# EAGLE design tex-v0 (EAGLE 7.6.0)
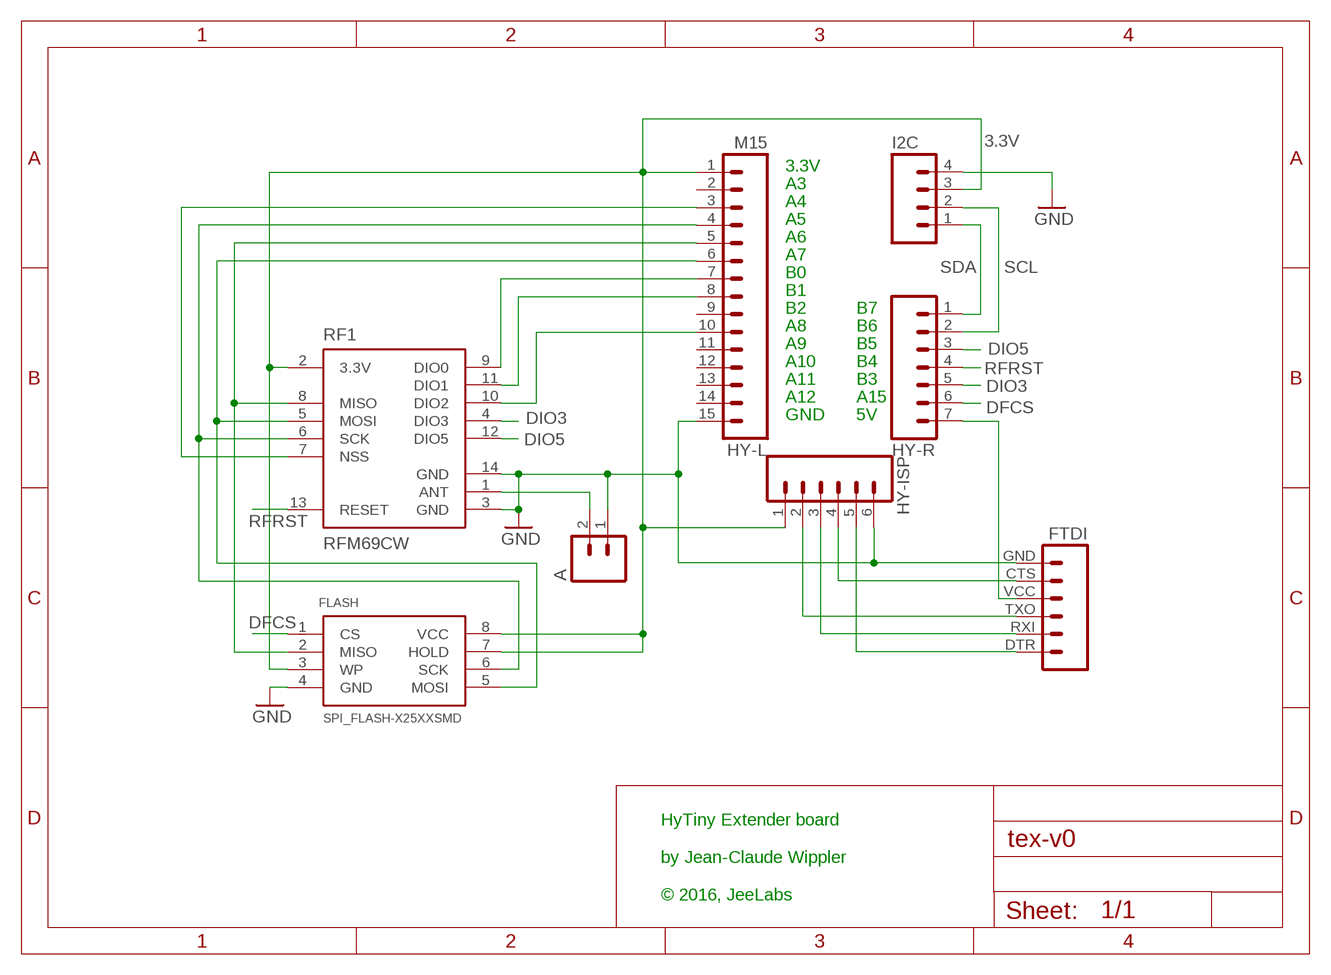
[diagram p0: schematic, sheet 1]

## Parts
A  M021X02_NO_SILK  [1X02_NO_SILK]
FLASH  SPI_FLASH-X25XXSMD  [SO08]
FTDI  FTDI_BASICPTH  [FTDI_BASIC]
HY-ISP  M06NO_SILK_FEMALE_PTH  [1X06_NO_SILK]
HY-L  M15  [1X15]
HY-R  M07  [1X07]
I2C  M041X04_NO_SILK  [1X04_NO_SILK]
RF1  RFM69CW  [RFM69CW-XXXS2]

## Nets
3.3V [power]: FLASH.3(WP) FLASH.7(HOLD) FLASH.8(VCC) HY-ISP.1 HY-L.1 I2C.3 RF1.2(3.3V)
DFCS [power]: FLASH.1(CS) HY-R.6
DIO3 [power]: HY-R.5 RF1.4(DIO3)
DIO5 [power]: HY-R.3 RF1.12(DIO5)
GND [power]: A.1 FLASH.4(GND) FTDI.GND HY-ISP.6 HY-L.15 I2C.4 RF1.3(GND) RF1.14(GND)
N$2: FLASH.2(MISO) HY-L.5 RF1.8(MISO)
N$3: FLASH.5(MOSI) HY-L.6 RF1.5(MOSI)
N$4: FLASH.6(SCK) HY-L.4 RF1.6(SCK)
N$5: HY-L.3 RF1.7(NSS)
N$6 [power]: FTDI.VCC HY-R.7
N$7: HY-L.7 RF1.9(DIO0)
N$8: HY-L.8 RF1.11(DIO1)
N$9 [power]: A.2 RF1.1(ANT)
N$10: FTDI.RXI HY-ISP.3
N$11: FTDI.TXO HY-ISP.2
N$12: FTDI.CTS HY-ISP.4
N$13: FTDI.DTR HY-ISP.5
N$14 [power]: HY-L.10 RF1.10(DIO2)
RFRST [power]: HY-R.4 RF1.13(RESET)
SCL: HY-R.2 I2C.2
SDA: HY-R.1 I2C.1
Unconnected: HY-L.2 HY-L.9 HY-L.11 HY-L.12 HY-L.13 HY-L.14

## Notes on the sheet
- 3.3V
- A3
- A4
- A5
- A6
- A7
- B0
- B1
- B2 | B7
- A8 | B6
- A9 | B5
- A10 | B4
- A11 | B3
- A12 | A15
- GND | 5V
- HyTiny Extender board
  
  by Jean-Claude Wippler
  
  © 2016, JeeLabs

## Library data of the parts
A = SparkFun-Connectors:M02: Standard 2-pin 0.1" header. Use with - straight break away headers ( PRT-00116) - right angle break away headers (PRT-00553) - swiss pins (PRT-00743) - machine pins (PRT-00117) - female headers (PRT-00115) Molex polarized connector foot print use with: PRT-08233 with associated crimp pins and housings. 2.54_SCREWTERM for use with PRT-10571. 3.5mm Screw Terminal footprints for PRT-08084 5mm Screw Terminal footprints for use with PRT-08432
FLASH = SparkFun-DigitalIC:SPI_FLASH-X25XX: 8pin SPI Flash series x25xx. Works with devices like W25X32 and BR25L32
FTDI = SparkFun-Connectors:FTDI_BASIC: FTDI Basic header with labels
HY-ISP = SparkFun-Connectors:M06: Header 6 Standard 6-pin 0.1" header. Use with straight break away headers (SKU : PRT-00116), right angle break away headers (PRT-00553), swiss pins (PRT-00743), machine pins (PRT-00117), and female headers (PRT-00115). Molex polarized connector foot print use with SKU : PRT-08094 with associated crimp pins and housings. NOTES ON THE VARIANTS LOCK and LOCK_LONGPADS... This footprint was designed to help hold the alignment of a through-hole component (i.e. 6-pin header) while soldering it into place. You may notice that each hole has been shifted either up or down by 0.005 of an inch from it's more standard position (which is a perfectly straight line). This slight alteration caused the pins (the squares in the middle) to touch the edges of the holes. Because they are alternating, it causes a "brace" to hold the component in place. 0.005 has proven to be the perfect amount of "off-center" position when using our standard breakaway headers. Although looks a little odd when you look at the bare footprint, once you have a header in there, the alteration is very hard to notice. Also,if you push a header all the way into place, it is covered up entirely on the bottom side. This idea of altering the position of holes to aid alignment will be further integrated into the Sparkfun Library for other footprints. It can help hold any component with 3 or more connection pins.; PROD_ID: CONN-08437
HY-L = SparkFun-Connectors:M15: Header 15 Standard 15-pin 0.1" header. Use with straight break away headers (SKU : PRT-00116), right angle break away headers (PRT-00553), swiss pins (PRT-00743), machine pins (PRT-00117), and female headers (PRT-00115).
HY-R = SparkFun-Connectors:M07: Header 7 Standard 7-pin 0.1" header. Use with straight break away headers (SKU : PRT-00116), right angle break away headers (PRT-00553), swiss pins (PRT-00743), machine pins (PRT-00117), and female headers (PRT-00115). NOTES ON THE VARIANTS LOCK and LOCK_LONGPADS... This footprint was designed to help hold the alignment of a through-hole component (i.e. 7-pin header) while soldering it into place. You may notice that each hole has been shifted either up or down by 0.005 of an inch from it's more standard position (which is usually a perfectly straight line). This slight alteration caused the pins (the squares in the middle) to touch the edges of the holes. Because they are alternating, it causes a "brace" to hold the header in place. 0.005 has proven to be the perfect amount of "off-center" position when using our standard breakaway headers. Although looks a little odd when you look at the bare footprint, once you have a header in there, the alteration is very hard to notice. Also, if you push a header all the way into place, it is covered up entirely on the bottom side. This idea of altering the position of holes to aid alignment will be further integrated into the Sparkfun Library for other footprints. It can help hold any component with 3 or more connection pins.
I2C = SparkFun-Connectors:M04: Header 4 Standard 4-pin 0.1" header. Use with straight break away headers (SKU : PRT-00116), right angle break away headers (PRT-00553), swiss pins (PRT-00743), machine pins (PRT-00117), and female headers (PRT-00115). Molex polarized connector foot print use with SKU : PRT-08231 with associated crimp pins and housings. 1MM SMD Version SKU: PRT-10208
RF1 = SparkFun-RF:RFM69

## Net classes
1 power: width 0.254 mm

## Board
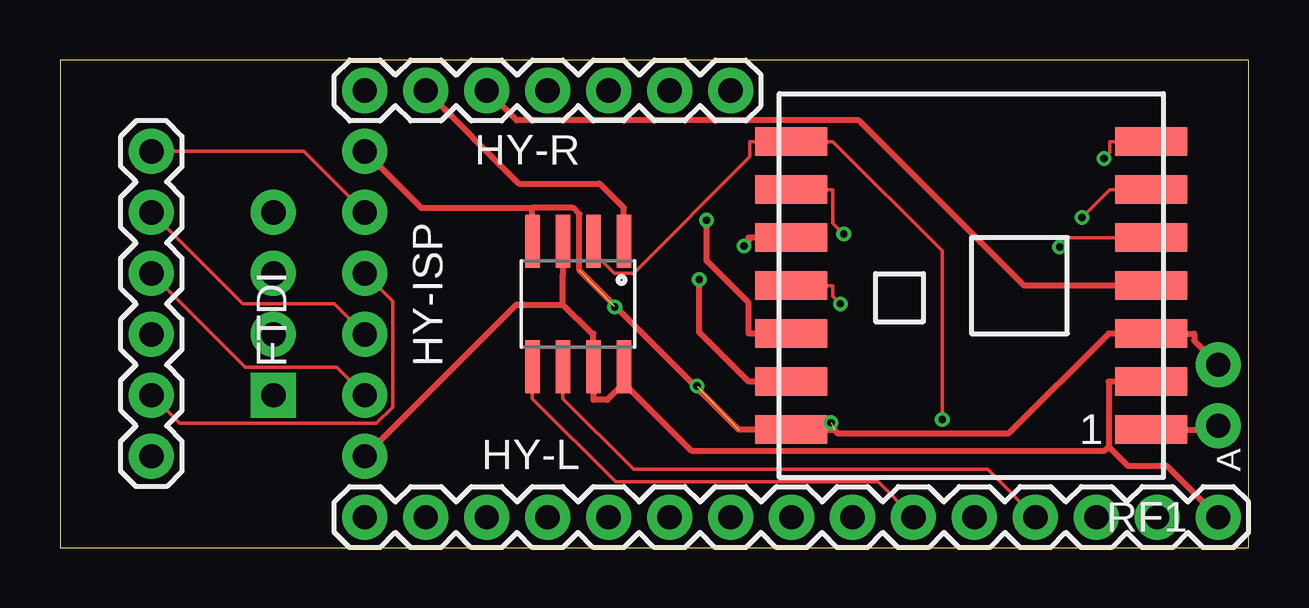
[diagram p1: board, top side]
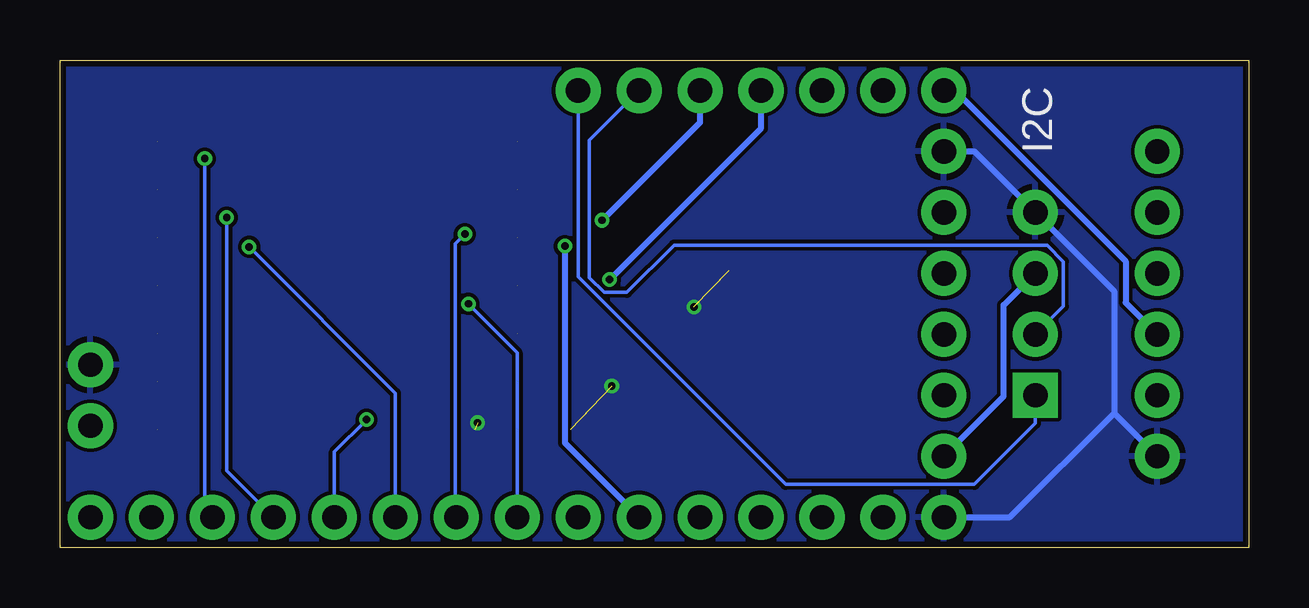
[diagram p2: board, bottom side, seen from below]

Size 49.53 x 20.32 mm. Coordinates in mm from the lower left corner, seen from the top.
Outline: 0,0 49.53,0 49.53,20.32 0,20.32 0,0
Copper layers (1*16): Top 0.035mm / dielectric 1.5mm / Bottom 0.035mm
Design rules "ITEADstudio_DRC": minimum track width 6mil, minimum drill 12mil, track to track 6mil, track to pad 6mil, pad to pad 6mil, via to via 6mil, smd to smd 0mil, copper to edge 10mil, drill to drill 10mil, minimum pad ring 10mil, minimum via ring 6mil, stop-mask expansion 2mil, vias tented up to drill 100mil, thermal gap 10mil

### Footprints (pad centres in the part's own frame; a part is rotated, then mirrored left to right if it is on the bottom)
1X02_NO_SILK = drill 1.016 pad 1.88: 1 0,0; 2 2.54,0
SO08 = smd 0.61 x 2.21: 1 -1.905,-2.616; 2 -0.635,-2.616; 3 0.635,-2.616; 4 1.905,-2.616; 5 1.905,2.616; 6 0.635,2.616; 7 -0.635,2.616; 8 -1.905,2.616
FTDI_BASIC = drill 1.016 pad 1.88: CTS 10.16,0; DTR 0,0; GND 12.7,0; RXI 2.54,0; TXO 5.08,0; VCC 7.62,0
1X06_NO_SILK = drill 1.016 pad 1.88: 1 0,0; 2 2.54,0; 3 5.08,0; 4 7.62,0; 5 10.16,0; 6 12.7,0
1X15 = drill 1.016 pad 1.88: 1 0,0; 2 2.54,0; 3 5.08,0; 4 7.62,0; 5 10.16,0; 6 12.7,0; 7 15.24,0; 8 17.78,0; 9 20.32,0; 10 22.86,0; 11 25.4,0; 12 27.94,0; 13 30.48,0; 14 33.02,0; 15 35.56,0
1X07 = drill 1.016 pad 1.88: 1 0,0; 2 2.54,0; 3 5.08,0; 4 7.62,0; 5 10.16,0; 6 12.7,0; 7 15.24,0
1X04_NO_SILK = drill 1.016 pad 1.88 square: 1 0,0 | drill 1.016 pad 1.88: 2 2.54,0; 3 5.08,0; 4 7.62,0
RFM69CW-XXXS2 = smd 3 x 1.2: 1 -7.5,6; 2 -7.5,4; 3 -7.5,2; 4 -7.5,0; 5 -7.5,-2; 6 -7.5,-4; 7 -7.5,-6; 8 7.5,-6; 9 7.5,-4; 10 7.5,-2; 11 7.5,0; 12 7.5,2; 13 7.5,4; 14 7.5,6

### Placement (x,y rotation side)
A  48.26,7.62 270 top
FLASH  21.59,10.16 180 top
FTDI  3.81,16.51 270 top
HY-ISP  12.7,3.81 90 top
HY-L  48.26,1.27 180 top
HY-R  27.94,19.05 180 top
I2C  8.89,6.35 90 bottom
RF1  37.97,10.92 180 top

### Tracks (layer width: path | path; a pad name or v marks a point on that pad's centre or on a via)
3.3V  (1 unrouted)
  Top 0.254: 23.5,6.85 26.3,4.04 43.53,4.04 43.69,4.21 | 23.5,6.85 22.8,6.16 22.23,6.16 FLASH.7 22.23,8.93 22.16,8.93 20.95,10.13 | 43.69,4.21 44.49,3.41 46.12,3.41 HY-L.1 | 43.69,4.21 43.69,6.92 RF1.2 | HY-ISP.1 19.02,10.13 20.95,10.13 | 20.95,10.13 20.95,11.39 FLASH.3 | FLASH.8 23.5,6.85
  Bottom 0.254: HY-ISP.1 10.21,6.3 10.21,10.11 I2C.3
DFCS
  Top 0.254: FLASH.1 23.5,14.16 22.49,15.17 19.12,15.17 HY-R.6
DIO3  (1 unrouted)
  Top 0.254: RF1.4 40.17,10.92 33.28,17.8 19.02,17.8 HY-R.5
DIO5  (via drill 0.3 pad 0.61)  (1 unrouted)
  Top 0.254: RF1.12 28.69,8.92 28.69,10.2 26.94,11.95 v26.94,13.64
  Bottom 0.254: v26.94,13.64 22.86,17.72 HY-R.3
GND  (via drill 0.3 pad 0.61)  (5 unrouted)
  Top 0.254: 19.68,14.16 21.38,14.16 21.64,13.9 21.64,11.55 28.27,4.92 RF1.14 32.25,4.92 32.43,4.75 39.52,4.75 43.69,8.92 RF1.3 47.25,8.92 47.25,8.63 A.1 | HY-ISP.6 15.05,14.16 19.68,14.16 | FLASH.4 19.68,14.16
  Bottom 0.254: 5.61,5.61 FTDI.GND | 5.61,5.61 5.61,10.69 I2C.4 11.43,16.51 HY-ISP.6 | HY-L.15 9.95,1.27 5.61,5.61
  other vias: 26.54,6.73 32.13,5.21 23.11,10.03
  pour Bottom: -1.27,21.59 50.8,21.59 50.8,-1.27 -1.27,-1.27
N$2  (via drill 0.3 pad 0.61)  (1 unrouted)
  Top 0.152: v36.76,5.34 36.76,12.37 32.2,16.92 RF1.8 28.74,16.92 28.74,16.29 23.9,11.44 23.09,11.44 22.23,12.31 FLASH.2
  Bottom 0.152: HY-L.5 38.1,3.99 v36.76,5.34
N$3  (via drill 0.3 pad 0.61)  (1 unrouted)
  Top 0.152: RF1.5 42.04,12.92 v41.65,12.53 | HY-L.6 34.09,2.74 23.15,2.74 19.68,6.21 FLASH.5
  Bottom 0.152: v41.65,12.53 35.56,6.44 HY-L.6
N$4  (via drill 0.3 pad 0.61)  (1 unrouted)
  Top 0.152: RF1.6 43.74,14.92 v42.59,13.76 | FLASH.6 20.95,6.21 23.91,3.26 38.65,3.26 HY-L.4
  Bottom 0.152: v42.59,13.76 42.59,3.22 HY-L.4
N$5  (via drill 0.3 pad 0.61)  (1 unrouted)
  Top 0.152: RF1.7 43.74,16.92 43.74,16.46 v43.5,16.21
  Bottom 0.152: v43.5,16.21 43.5,1.59 HY-L.3
N$6
  Bottom 0.254: HY-R.7 12.24,19.05 5.13,11.94 5.13,10.21 FTDI.VCC
N$7  (via drill 0.3 pad 0.61)  (1 unrouted)
  Top 0.152: RF1.9 32.2,14.92 32.2,13.52 v32.66,13.07
  Bottom 0.152: v32.66,13.07 33.05,12.67 33.05,1.3 HY-L.7
N$8  (via drill 0.3 pad 0.61)  (1 unrouted)
  Top 0.152: RF1.11 32.2,10.92 32.2,10.47 v32.51,10.16
  Bottom 0.152: v32.51,10.16 30.48,8.13 HY-L.8
N$9  (1 unrouted)
  Top 0.254: RF1.1 48.1,4.92 A.2
N$10
  Top 0.152: HY-ISP.3 11.43,10.16 7.62,10.16 FTDI.RXI
N$11
  Top 0.152: HY-ISP.2 11.53,7.52 7.72,7.52 FTDI.TXO
N$12
  Top 0.152: HY-ISP.4 13.87,10.26 13.87,5.86 13.19,5.18 4.98,5.18 FTDI.CTS
N$13
  Top 0.152: HY-ISP.5 10.16,16.51 FTDI.DTR
N$14  (via drill 0.3 pad 0.61)  (1 unrouted)
  Top 0.254: RF1.10 28.69,12.92 28.69,12.77 v28.5,12.57
  Bottom 0.254: v28.5,12.57 28.5,4.37 HY-L.10
RFRST  (via drill 0.3 pad 0.61)  (1 unrouted)
  Top 0.254: RF1.13 28.69,6.92 26.63,8.98 v26.63,11.17
  Bottom 0.254: v26.63,11.17 20.32,17.48 HY-R.4
SCL
  Bottom 0.152: I2C.2 7.72,10.06 7.72,11.92 8.4,12.6 23.94,12.6 25.91,10.63 26.86,10.63 27.48,11.26 27.48,16.97 HY-R.2
SDA
  Bottom 0.152: I2C.1 8.89,5.18 11.43,2.64 19.29,2.64 27.94,11.29 HY-R.1